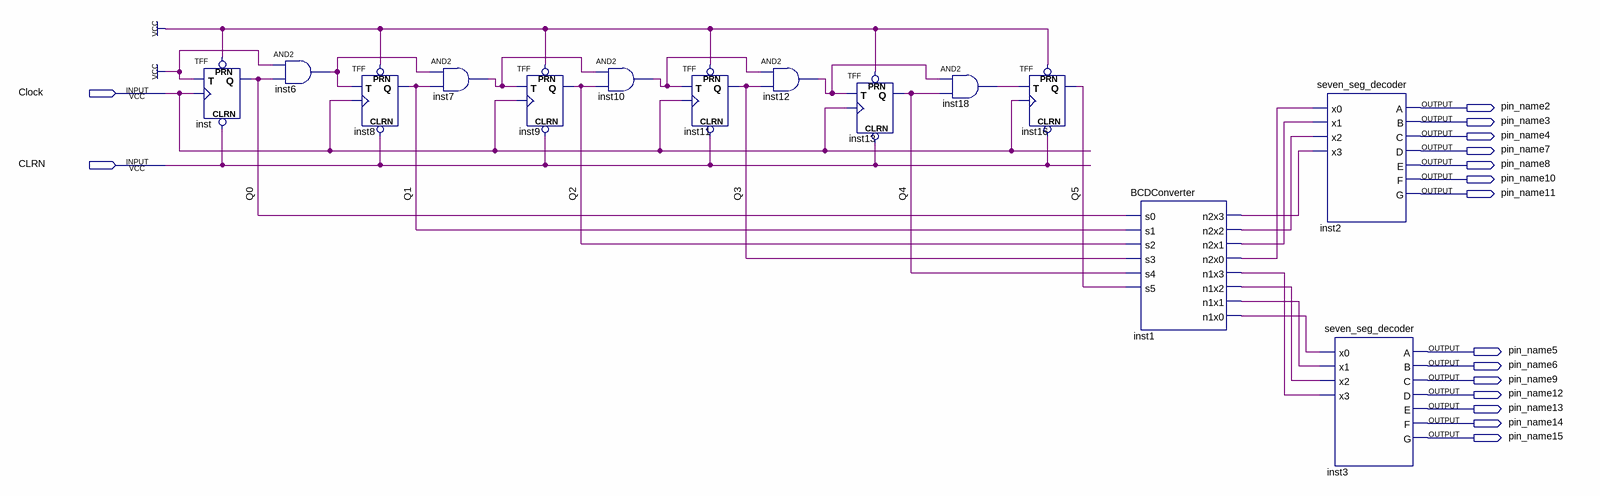
[diagram p0: schematic sheet]
// Quartus schematic studentCounter.bdf as structural Verilog: 14 symbols, 16 pins
module studentCounter (
  input  Clock,
  input  CLRN,
  output pin_name2,
  output pin_name3,
  output pin_name4,
  output pin_name7,
  output pin_name8,
  output pin_name10,
  output pin_name11,
  output pin_name5,
  output pin_name6,
  output pin_name9,
  output pin_name12,
  output pin_name13,
  output pin_name14,
  output pin_name15
);

  wire inst1_n1x0, inst1_n1x1, inst1_n1x2, inst1_n1x3, inst1_n2x0, inst1_n2x1, inst1_n2x2, inst1_n2x3,
       inst6_out, inst7_out, inst10_out, inst12_out, inst18_out, Q0, Q1, Q2, Q3, Q4, Q5;

  TFF inst (.PRN(1'b1), .CLRN(CLRN), .T(1'b1), .CLK(Clock), .Q(Q0));
  and inst6 (inst6_out, 1'b1, Q0);
  TFF inst8 (.PRN(1'b1), .CLRN(CLRN), .T(inst6_out), .CLK(Clock), .Q(Q1));
  and inst7 (inst7_out, inst6_out, Q1);
  TFF inst9 (.PRN(1'b1), .CLRN(CLRN), .T(inst7_out), .CLK(Clock), .Q(Q2));
  and inst10 (inst10_out, inst7_out, Q2);
  TFF inst11 (.PRN(1'b1), .CLRN(CLRN), .T(inst10_out), .CLK(Clock), .Q(Q3));
  and inst12 (inst12_out, inst10_out, Q3);
  TFF inst13 (.PRN(1'b1), .CLRN(CLRN), .T(inst12_out), .CLK(Clock), .Q(Q4));
  and inst18 (inst18_out, inst12_out, Q4);
  TFF inst16 (.PRN(1'b1), .CLRN(CLRN), .T(inst18_out), .CLK(Clock), .Q(Q5));
  BCDConverter inst1 (
    .s0(Q0), .s1(Q1), .s2(Q2), .s3(Q3), .s4(Q4), .s5(Q5), .n2x3(inst1_n2x3), .n2x2(inst1_n2x2),
    .n2x1(inst1_n2x1), .n2x0(inst1_n2x0), .n1x3(inst1_n1x3), .n1x2(inst1_n1x2), .n1x1(inst1_n1x1),
    .n1x0(inst1_n1x0));
  seven_seg_decoder inst2 (
    .x0(inst1_n2x0), .x1(inst1_n2x1), .x2(inst1_n2x2), .x3(inst1_n2x3), .A(pin_name2), .B(pin_name3),
    .C(pin_name4), .D(pin_name7), .E(pin_name8), .F(pin_name10), .G(pin_name11));
  seven_seg_decoder inst3 (
    .x0(inst1_n1x0), .x1(inst1_n1x1), .x2(inst1_n1x2), .x3(inst1_n1x3), .A(pin_name5), .B(pin_name6),
    .C(pin_name9), .D(pin_name12), .E(pin_name13), .F(pin_name14), .G(pin_name15));
endmodule
